# EAGLE design driver (EAGLE 6.1)

## Sheet 1 of 2
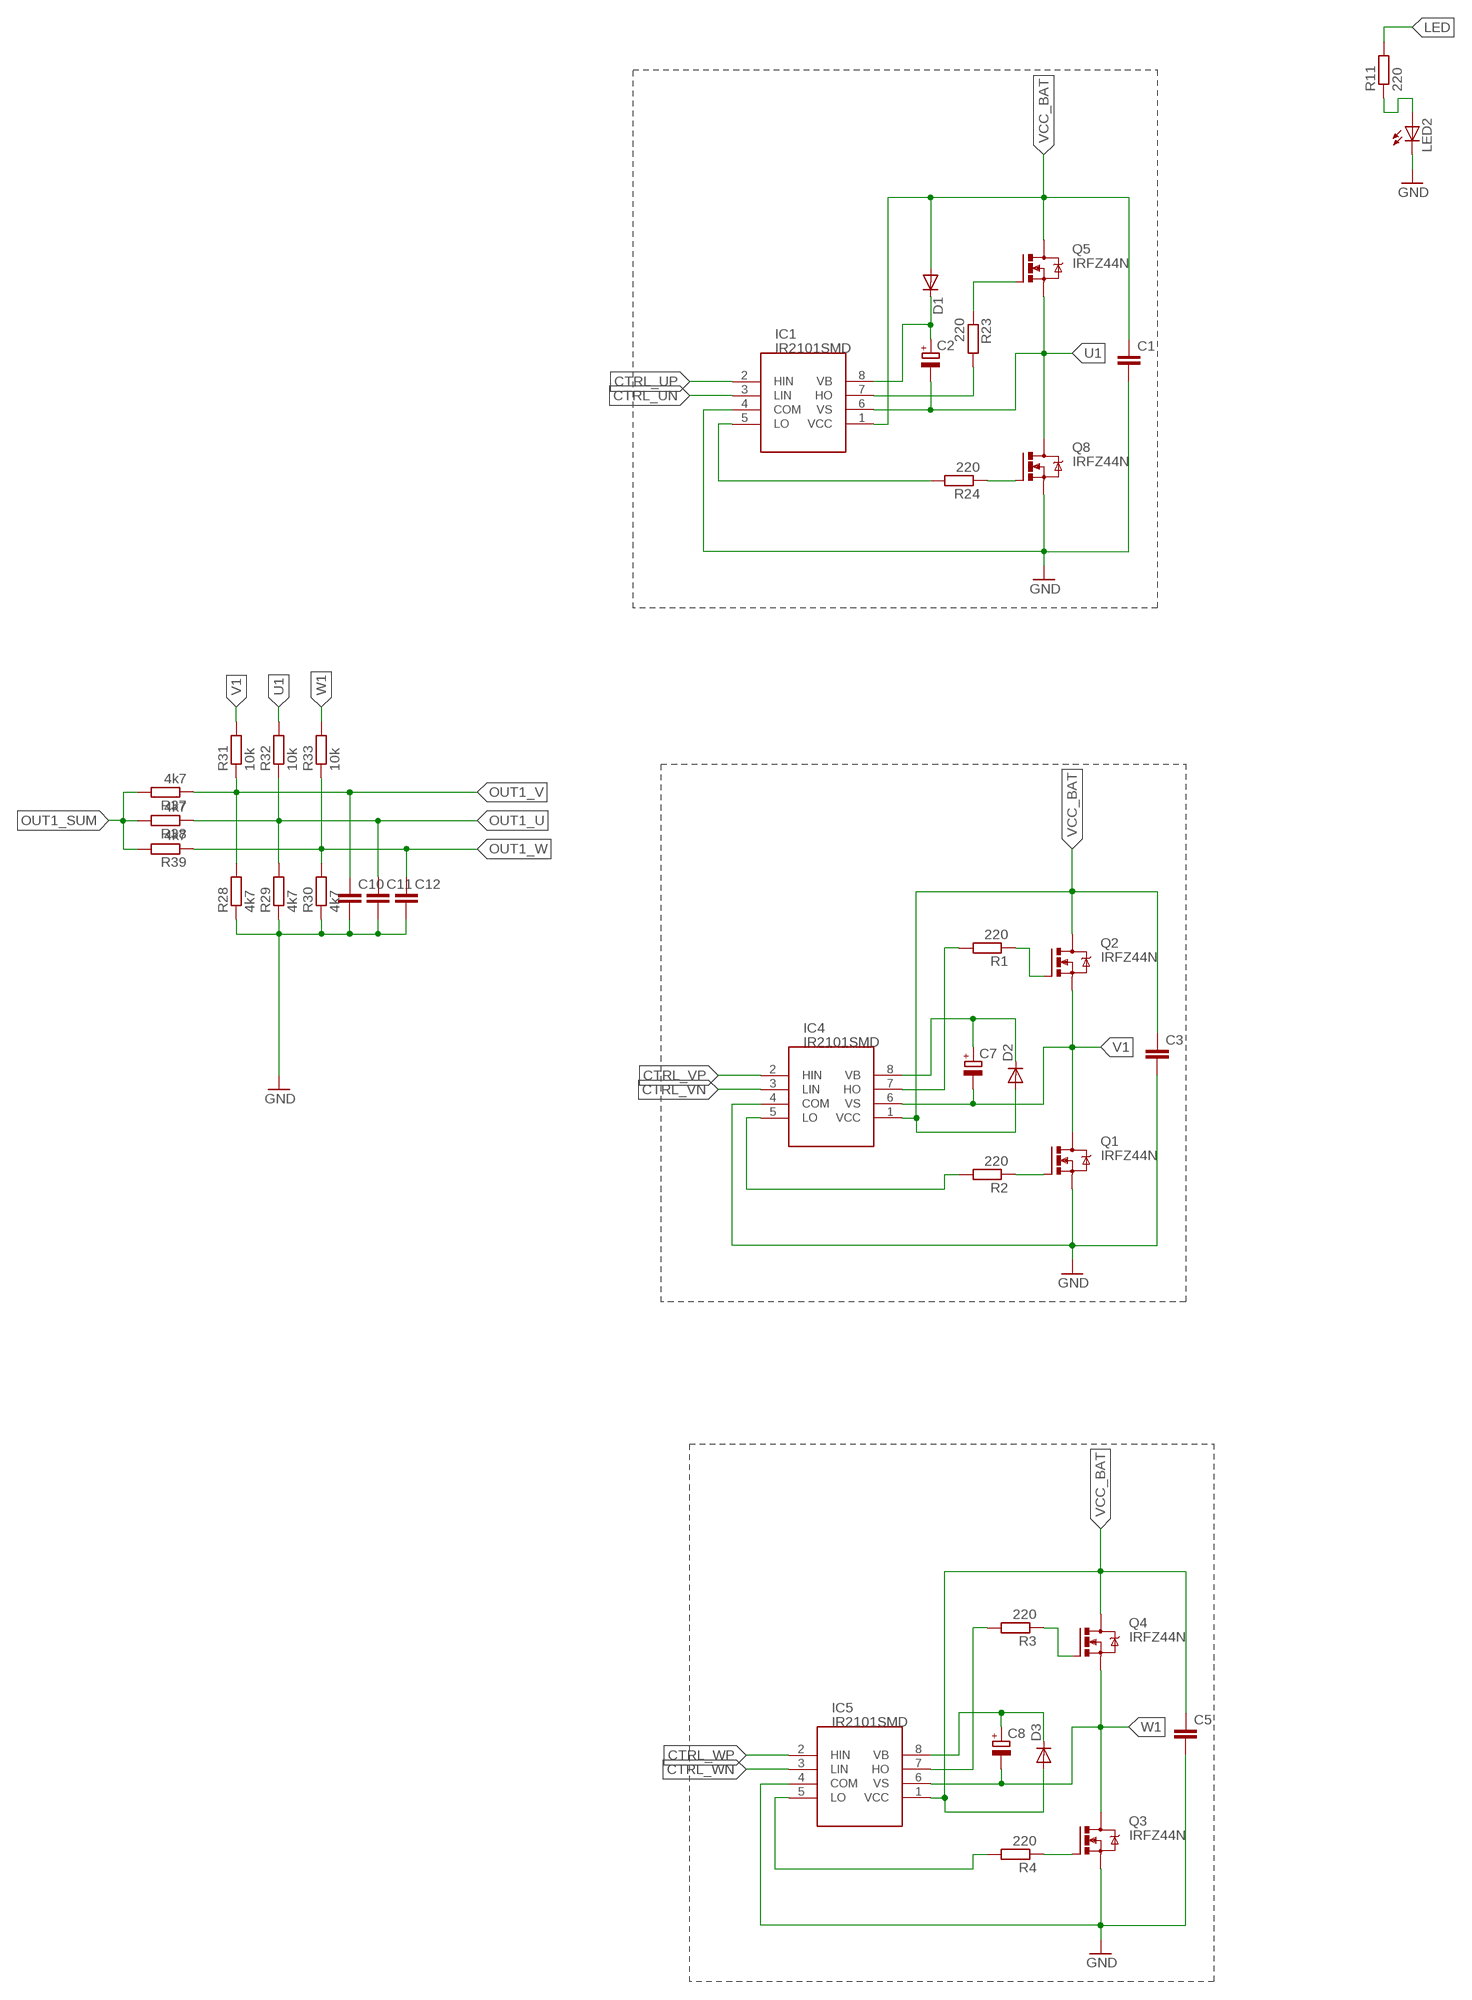
[diagram p0: schematic, sheet 1, part 1 of 2]
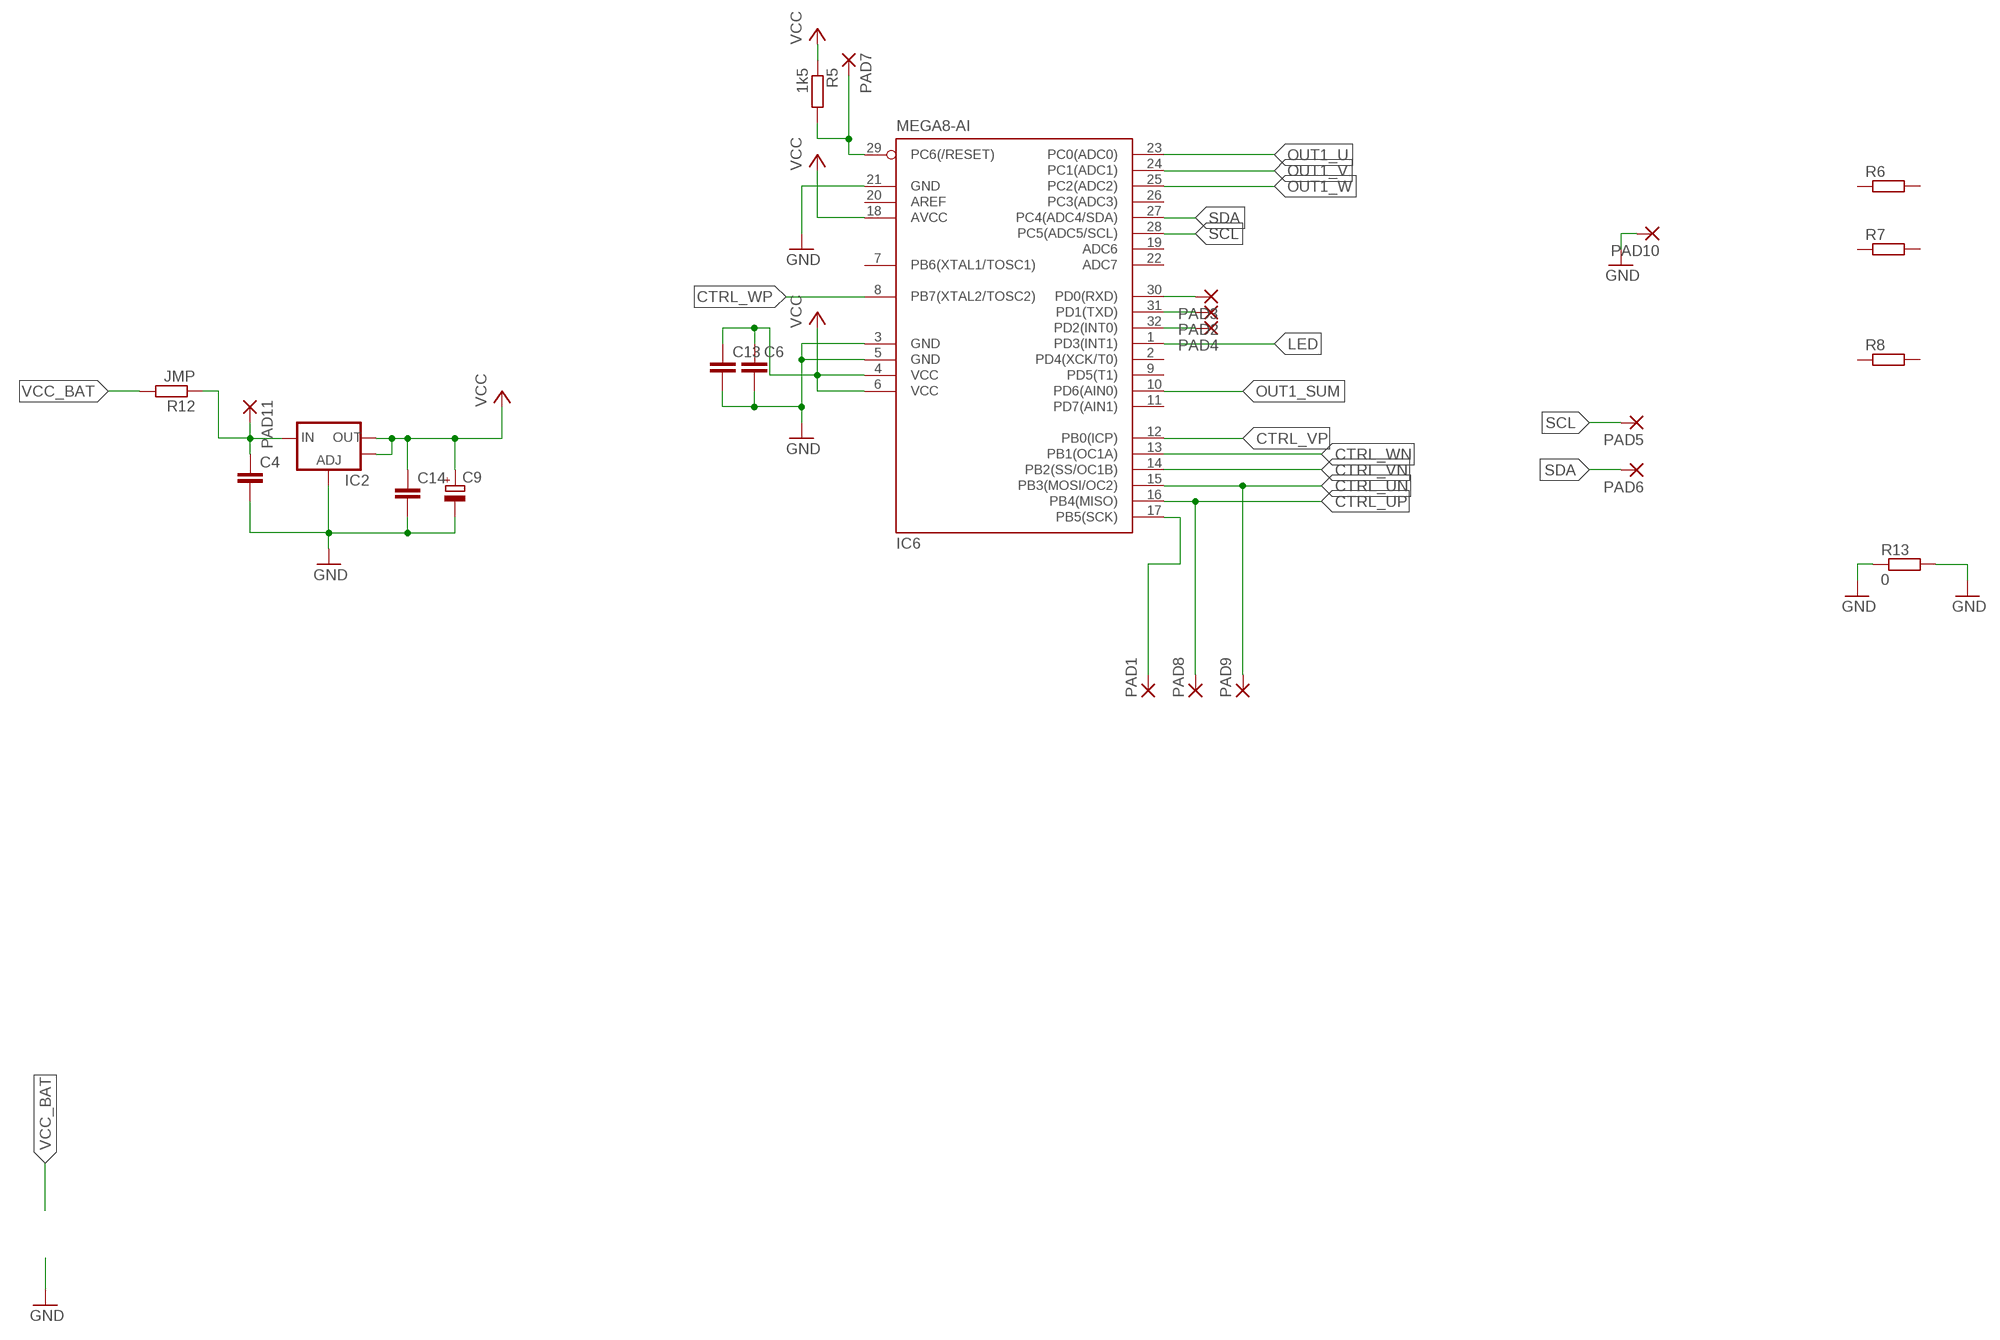
[diagram p1: schematic, sheet 1, part 2 of 2]

### Parts
C1  C-EUC0805  [C0805]
C2  CPOL-EUSANYO_SMD_A5  [SANYO-OSCON_SMD_A5]
C3  C-EUC0805  [C0805]
C4  C-EUC0805  [C0805]
C5  C-EUC0805  [C0805]
C6  C-EUC0805  [C0805]
C7  CPOL-EUSANYO_SMD_A5  [SANYO-OSCON_SMD_A5]
C8  CPOL-EUSANYO_SMD_A5  [SANYO-OSCON_SMD_A5]
C9  CPOL-EUSANYO_SMD_A5  [SANYO-OSCON_SMD_A5]
C10  C-EUC0805  [C0805]
C11  C-EUC1206  [C1206]
C12  C-EUC1206  [C1206]
C13  C-EUC0805  [C0805]
C14  C-EUC0805  [C0805]
D1  DIODE-MINIMELF  [MINIMELF]
D2  DIODE-MINIMELF  [MINIMELF]
D3  DIODE-MINIMELF  [MINIMELF]
IC1  IR2101SMD  [SO08]
IC2  V_REG_LM1117SOT223  [SOT223]
IC4  IR2101SMD  [SO08]
IC5  IR2101SMD  [SO08]
IC6  MEGA8-AI  [TQFP32-08]
LED2  LEDCHIPLED_0805  [CHIPLED_0805]
PAD1  SMD2  [SMD1,27-2,54]
PAD2  SMD2  [SMD1,27-2,54]
PAD3  SMD2  [SMD1,27-2,54]
PAD4  SMD2  [SMD1,27-2,54]
PAD5  SMD5  [SMD2,54-5,08]
PAD6  SMD5  [SMD2,54-5,08]
PAD7  SMD2  [SMD1,27-2,54]
PAD8  SMD2  [SMD1,27-2,54]
PAD9  SMD2  [SMD1,27-2,54]
PAD10  SMD5  [SMD2,54-5,08]
PAD11  SMD5  [SMD2,54-5,08]
Q1  IRFZ44N  IRFZ48  [TO220BH-FILL]
Q2  IRFZ44N  IRFZ48  [TO220BH-FILL]
Q3  IRFZ44N  IRFZ48  [TO220BH-FILL]
Q4  IRFZ44N  IRFZ48  [TO220BH-FILL]
Q5  IRFZ44N  IRFZ48  [TO220BH-FILL]
Q8  IRFZ44N  IRFZ48  [TO220BH-FILL]
R1  220  R-EU_R1206  [R1206]
R2  220  R-EU_R1206  [R1206]
R3  220  R-EU_R1206  [R1206]
R4  220  R-EU_R1206  [R1206]
R5  1k5  R-EU_R1206  [R1206]
R6  R-EU_R1206  [R1206]
R7  R-EU_R1206  [R1206]
R8  R-EU_R1206  [R1206]
R11  220  R-EU_R0805  [R0805]
R12  JMP  R-EU_R0805  [R0805]
R13  0  R-EU_R1206  [R1206]
R23  220  R-EU_R1206  [R1206]
R24  220  R-EU_R1206  [R1206]
R28  4k7  R-EU_R0805  [R0805]
R29  4k7  R-EU_R1206  [R1206]
R30  4k7  R-EU_R1206  [R1206]
R31  10k  R-EU_R0805  [R0805]
R32  10k  R-EU_R1206  [R1206]
R33  10k  R-EU_R1206  [R1206]
R37  4k7  R-EU_R0805  [R0805]
R38  4k7  R-EU_R0805  [R0805]
R39  4k7  R-EU_R1206  [R1206]

### Nets
CTRL_UN: IC1.3(LIN) IC6.15(PB3(MOSI/OC2)) PAD9.1(P)
CTRL_UP: IC1.2(HIN) IC6.16(PB4(MISO)) PAD8.1(P)
CTRL_VN: IC4.3(LIN) IC6.14(PB2(SS/OC1B))
CTRL_VP: IC4.2(HIN) IC6.12(PB0(ICP))
CTRL_WN: IC5.3(LIN) IC6.13(PB1(OC1A))
CTRL_WP: IC5.2(HIN) IC6.8(PB7(XTAL2/TOSC2))
GND: C1.2 C3.2 C4.2 C5.2 C6.2 C9.- C10.2 C11.2 C12.2 C13.2 C14.2 IC1.4(COM) IC2.1(ADJ) IC4.4(COM) IC5.4(COM) IC6.3(GND) IC6.5(GND) IC6.21(GND) LED2.C PAD10.1(P) Q1.S Q3.S Q8.S R13.1 R13.2 R28.1 R29.1 R30.1
LED: IC6.1(PD3(INT1)) R11.2
N$1: IC1.5(LO) R24.2
N$2: IC1.7(HO) R23.2
N$3: Q2.G R1.1
N$4: Q1.G R2.1
N$5: C2.+ D1.C IC1.8(VB)
N$6: IC4.5(LO) R2.2
N$7: IC4.7(HO) R1.2
N$8: C7.+ D2.C IC4.8(VB)
N$9: Q4.G R3.1
N$10: Q3.G R4.1
N$11: IC5.5(LO) R4.2
N$12: IC5.7(HO) R3.2
N$13: C8.+ D3.C IC5.8(VB)
N$14: IC6.29(PC6(/RESET)) PAD7.1(P) R5.2
N$16: IC6.17(PB5(SCK)) PAD1.1(P)
N$17: IC6.30(PD0(RXD)) PAD3.1(P)
N$18: IC6.31(PD1(TXD)) PAD2.1(P)
N$19: IC6.32(PD2(INT0)) PAD4.1(P)
N$22: Q5.G R23.1
N$24: Q8.G R24.1
N$27: LED2.A R11.1
N$29: C4.1 IC2.3(IN) PAD11.1(P) R12.1
OUT1_SUM: IC6.10(PD6(AIN0)) R37.2 R38.2 R39.2
OUT1_U: C11.1 IC6.23(PC0(ADC0)) R29.2 R32.1 R38.1
OUT1_V: C10.1 IC6.24(PC1(ADC1)) R28.2 R31.1 R37.1
OUT1_W: C12.1 IC6.25(PC2(ADC2)) R30.2 R33.1 R39.1
SCL: IC6.28(PC5(ADC5/SCL)) PAD5.1(P)
SDA: IC6.27(PC4(ADC4/SDA)) PAD6.1(P)
U1: C2.- IC1.6(VS) Q5.S Q8.D R32.2
V1: C7.- IC4.6(VS) Q1.D Q2.S R31.2
VCC: C6.1 C9.+ C13.1 C14.1 IC2.2(OUT) IC2.4(OUT) IC6.4(VCC) IC6.6(VCC) IC6.18(AVCC) R5.1
VCC_BAT: C1.1 C3.1 C5.1 D1.A D2.A D3.A IC1.1(VCC) IC4.1(VCC) IC5.1(VCC) Q2.D Q4.D Q5.D R12.2
W1: C8.- IC5.6(VS) Q3.D Q4.S R33.2
Unconnected: IC6.2(PD4(XCK/T0)) IC6.7(PB6(XTAL1/TOSC1)) IC6.9(PD5(T1)) IC6.11(PD7(AIN1)) IC6.19(ADC6) IC6.20(AREF) IC6.22(ADC7) IC6.26(PC3(ADC3)) R6.1 R6.2 R7.1 R7.2 R8.1 R8.2

## Sheet 2 of 2

## Library data of the parts
C1 C3-C6 C10-C14 = rcl-kd:C-EU: CAPACITOR, European symbol
C2 C7-C9 = rcl-kd:CPOL-EU: POLARIZED CAPACITOR, European symbol
D1-D3 = diode:DIODE-: DIODE
IC1 IC4 IC5 = IR:IR2101
IC2 = SparkFun:V_REG_LM1117: Voltage Regulator LM1117 Standard adjustable voltage regulator but in SMD form. Spark Fun Electronics SKU : COM-00595
IC6 = atmel:MEGA8: MICROCONTROLLER 8 Kbytes FLASH, 1 kbytes SRAM, 512 bytes EEPROM, USART, 6-channel 10 bit ADC, 2-channel 8 bit ADC Pin compatible with Atmega48, ATMega88, ATMega168 Source: avr.lbr; MPN: ATMEGA8-16AU; OC_FARNELL: 9171371; OC_NEWARK: 73M8863
LED2 = adafruit:LED: LED OSRAM: - CHIPLED LG R971, LG N971, LY N971, LG Q971, LY Q971, LO R971, LY R971 LH N974, LH R974 LS Q976, LO Q976, LY Q976 LO Q996 - Hyper CHIPLED LW Q18S LB Q993, LB Q99A, LB R99A - SideLED LS A670, LO A670, LY A670, LG A670, LP A670 LB A673, LV A673, LT A673, LW A673 LH A674 LY A675 LS A676, LA A676, LO A676, LY A676, LW A676 LS A679, LY A679, LG A679 - Hyper Micro SIDELED® LS Y876, LA Y876, LO Y876, LY Y876 LT Y87S - SmartLED LW L88C, LW L88S LB L89C, LB L89S, LG L890 LS L89K, LO L89K, LY L89K LS L896, LA L896, LO L896, LY L896 - TOPLED LS T670, LO T670, LY T670, LG T670, LP T670 LSG T670, LSP T670, LSY T670, LOP T670, LYG T670 LG T671, LOG T671, LSG T671 LB T673, LV T673, LT T673, LW T673 LH T674 LS T676, LA T676, LO T676, LY T676, LB T676, LH T676, LSB T676, LW T676 LB T67C, LV T67C, LT T67C, LS T67K, LO T67K, LY T67K, LW E67C LS E67B, LA E67B, LO E67B, LY E67B, LB E67C, LV E67C, LT E67C LW T67C LS T679, LY T679, LG T679 LS T770, LO T770, LY T770, LG T770, LP T770 LB T773, LV T773, LT T773, LW T773 LH T774 LS E675, LA E675, LY E675, LS T675 LS T776, LA T776, LO T776, LY T776, LB T776 LHGB T686 LT T68C, LB T68C - Hyper Mini TOPLED® LB M676 - Mini TOPLED Santana® LG M470 LS M47K, LO M47K, LY M47K Source: http://www.osram.convergy.de/
PAD1-PAD4 PAD7-PAD9 = wirepad:SMD2: SMD PAD
PAD5 PAD6 PAD10 PAD11 = wirepad:SMD5: SMD PAD
Q1-Q5 Q8 = transistor-power-kd:IRFZ48: N Channel HEXFET® Power MOSFET Logic Level Source: http://www.irf.com/product-info/datasheets/data/irfz48z.pdf
R1-R8 R13 R23 R24 R28-R33 R37-R39 = rcl-kd:R-EU_: RESISTOR, European symbol
R11 R12 = resistor:R-EU_: RESISTOR, European symbol

## Board
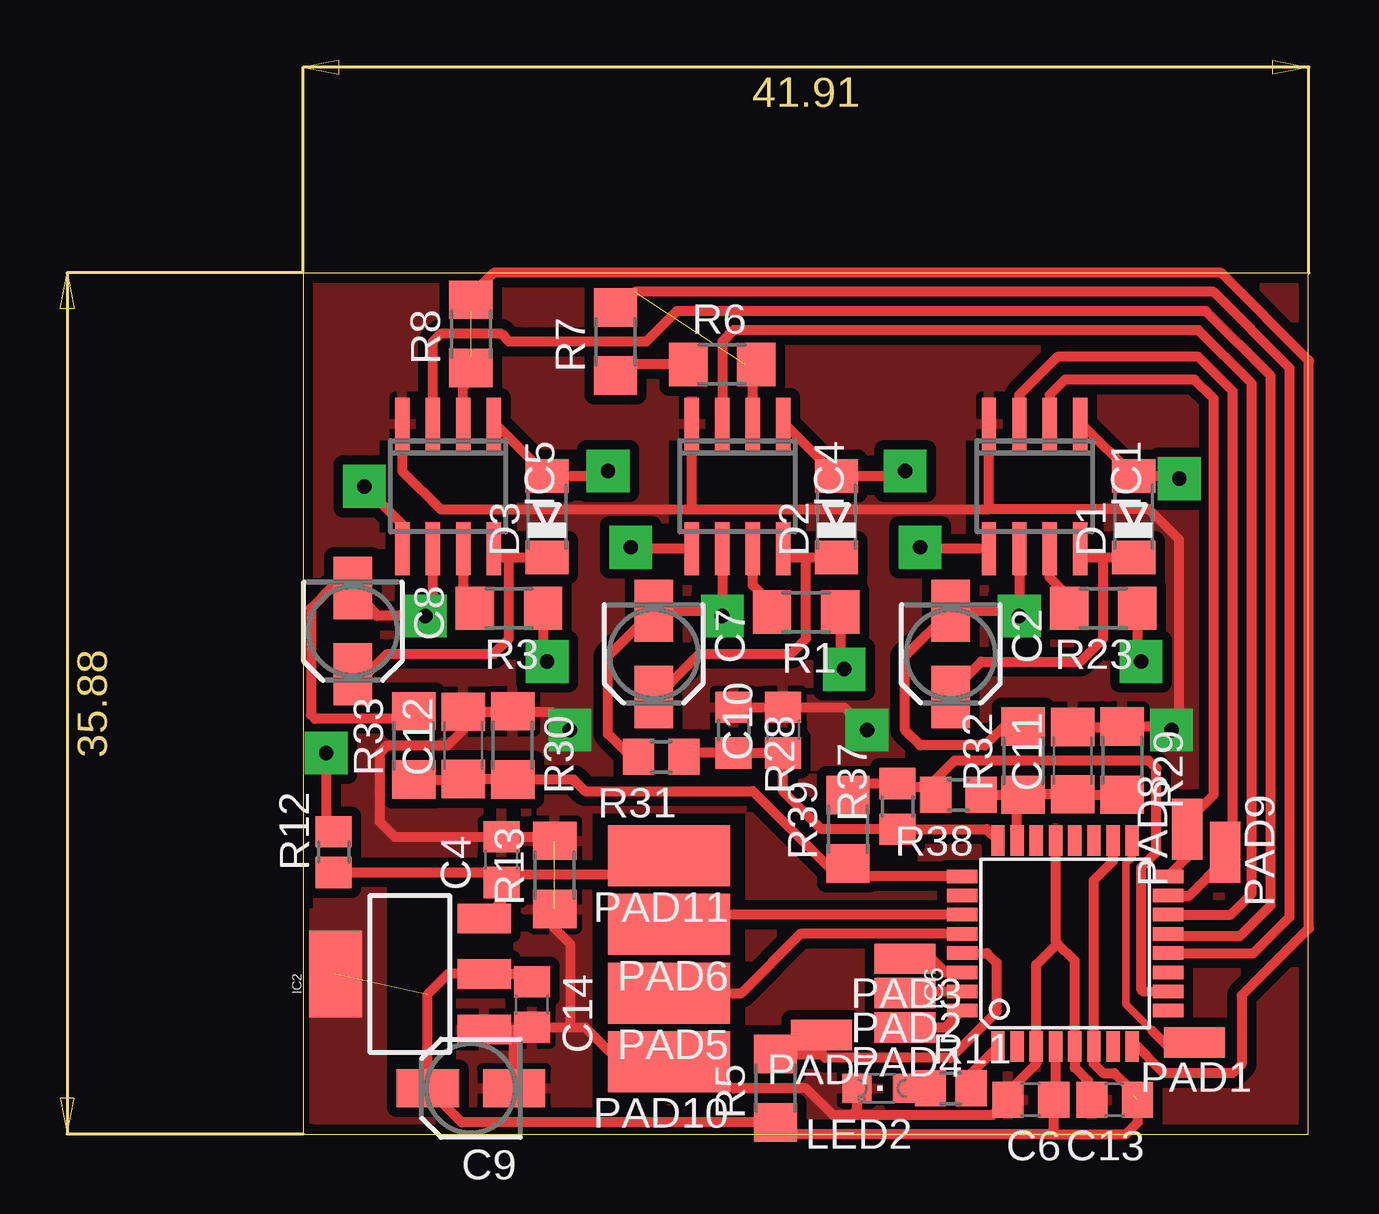
[diagram p2: board, top side]
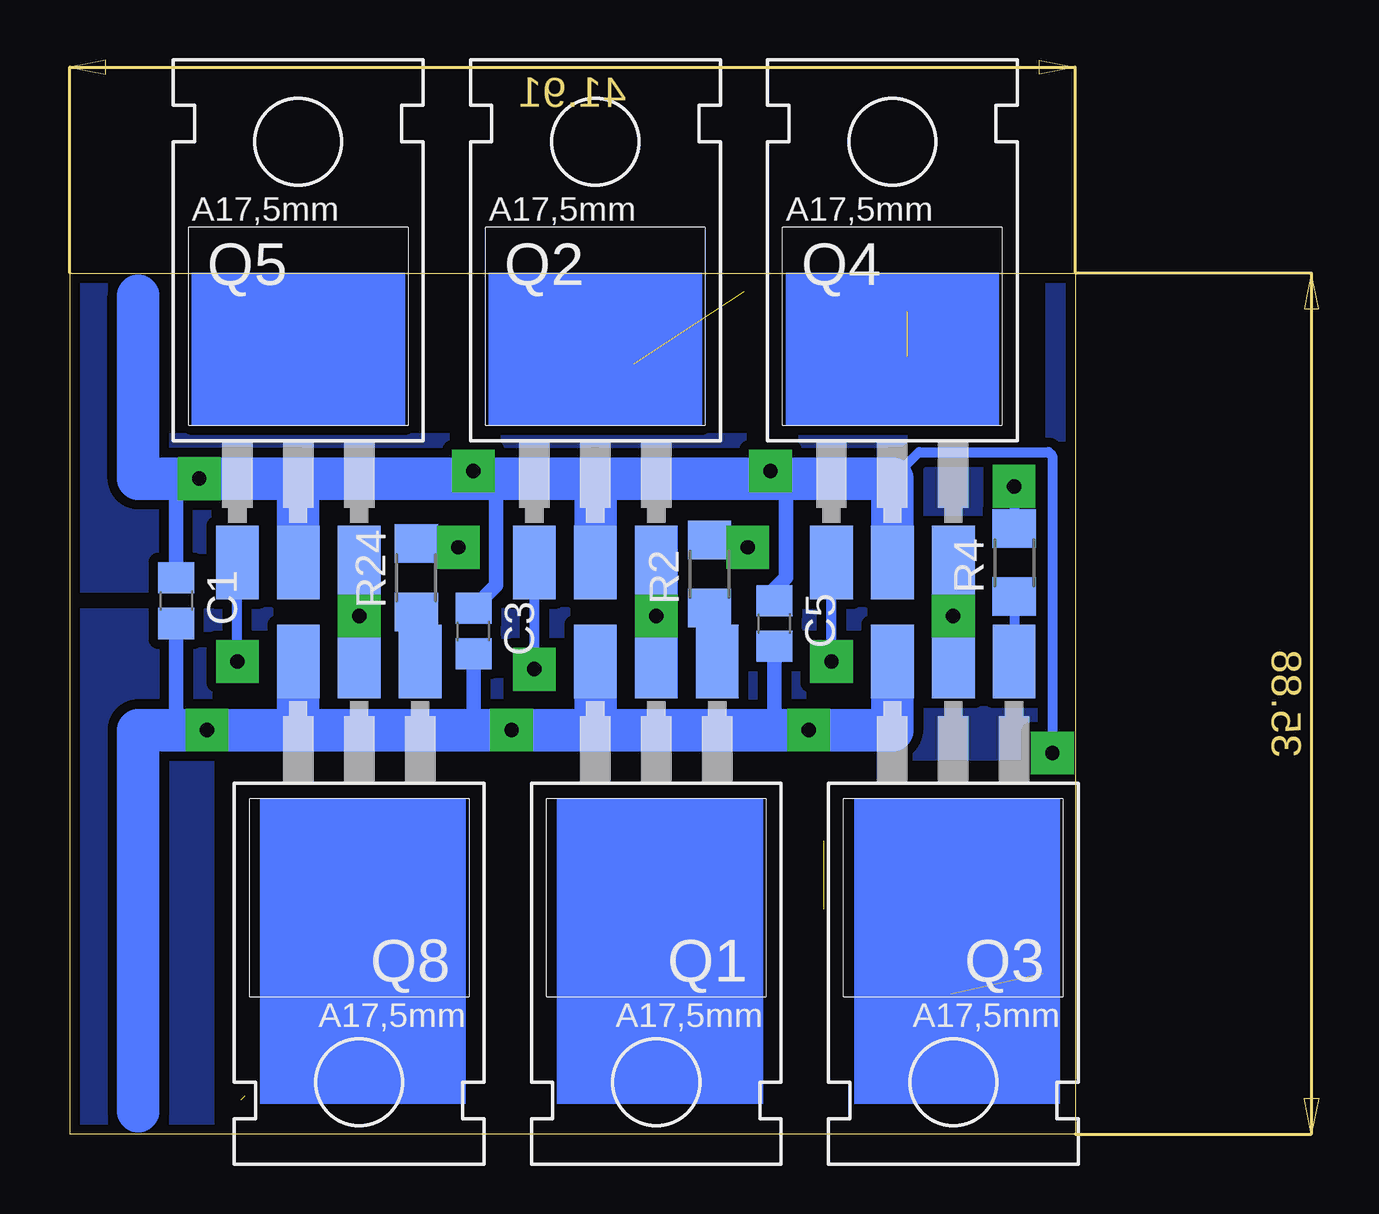
[diagram p3: board, bottom side, seen from below]

Size 41.89 x 35.87 mm. Coordinates in mm from the lower left corner, seen from the top.
Outline: 0,0 41.89,0 41.89,35.87 0,35.87 0,0
Copper layers (1*16): Top 0.035mm / dielectric 1.5mm / Bottom 0.035mm
Design rules: minimum track width 10mil, minimum drill 12mil, track to track 4mil, track to pad 4mil, pad to pad 4mil, via to via 4mil, smd to smd 4mil, copper to edge 10mil, drill to drill 8mil, minimum pad ring 10mil, minimum via ring 8mil, stop-mask expansion 4mil, vias tented up to drill 0mil, thermal gap 10mil

### Footprints (pad centres in the part's own frame; a part is rotated, then mirrored left to right if it is on the bottom)
C0805 = smd 1.3 x 1.5: 1 -0.95,0; 2 0.95,0
SANYO-OSCON_SMD_A5 = smd 2.6 x 1.6: + 1.8,0; - -1.8,0
C1206 = smd 1.6 x 1.8: 1 -1.4,0; 2 1.4,0
MINIMELF = smd 1.4 x 1.8: A 1.7,0; C -1.7,0
SO08 = smd 0.6 x 2.2: 1 -1.905,-2.6; 2 -0.635,-2.6; 3 0.635,-2.6; 4 1.905,-2.6; 5 1.905,2.6; 6 0.635,2.6; 7 -0.635,2.6; 8 -1.905,2.6
SOT223 = smd 1.219 x 2.235: 1 -2.311,-3.099; 2 0,-3.099; 3 2.311,-3.099 | smd 3.6 x 2.2: 4 0,3.099
TQFP32-08 = smd 1.27 x 0.559: 1 -4.293,2.8; 2 -4.293,2; 3 -4.293,1.2; 4 -4.293,0.4; 5 -4.293,-0.4; 6 -4.293,-1.2; 7 -4.293,-2; 8 -4.293,-2.8; 17 4.293,-2.8; 18 4.293,-2; 19 4.293,-1.2; 20 4.293,-0.4; 21 4.293,0.4; 22 4.293,1.2; 23 4.293,2; 24 4.293,2.8 | smd 0.559 x 1.27: 9 -2.8,-4.293; 10 -2,-4.293; 11 -1.2,-4.293; 12 -0.4,-4.293; 13 0.4,-4.293; 14 1.2,-4.293; 15 2,-4.293; 16 2.8,-4.293; 25 2.8,4.293; 26 2,4.293; 27 1.2,4.293; 28 0.4,4.293; 29 -0.4,4.293; 30 -1.2,4.293; 31 -2,4.293; 32 -2.8,4.293
CHIPLED_0805 = smd 1.2 x 1.2: A 0,-1.05; C 0,1.05
SMD1,27-2,54 = smd 1.27 x 2.54: 1 0,0
SMD2,54-5,08 = smd 2.54 x 5.08: 1 0,0
TO220BH-FILL = smd 1.778 x 3.048: D 0,-10.16; G -2.54,-10.16; S 2.54,-10.16
R1206 = smd 1.6 x 1.803: 1 -1.422,0; 2 1.422,0
R0805 = smd 1.3 x 1.5: 1 -0.85,0; 2 0.85,0
R0805' = smd 1.3 x 1.5: 1 -0.95,0; 2 0.95,0

### Placement (x,y rotation side)
C1  37.47,22.23 270 bottom
C2  26.99,20 270 top
C3  25.08,20.95 270 bottom
C4  8.26,11.43 90 top
C5  12.54,21.27 270 bottom
C6  30.32,1.43 180 top
C7  14.61,20 270 top
C8  2.06,20.95 270 top
C9  6.99,1.91 180 top
C10  20,16.83 90 top
C11  32.07,15.56 90 top
C12  6.67,16.19 90 top
C13  33.81,1.43 180 top
C14  9.53,5.4 270 top
D1  34.61,25.72 90 top
D2  22.23,25.72 90 top
D3  10.16,25.72 90 top
IC1  30.48,26.99 180 top
IC2  4.45,6.67 90 top
IC4  18.1,26.99 180 top
IC5  6.03,26.99 180 top
IC6  31.75,7.94 90 top
LED2  24.13,1.91 90 top
PAD1  37.15,3.81 90 top
PAD2  25.08,5.87 90 top
PAD3  25.08,7.3 90 top
PAD4  25.08,4.45 90 top
PAD5  15.24,5.87 90 top
PAD6  15.24,8.73 90 top
PAD7  21.59,4.13 90 top
PAD8  36.83,12.7 0 top
PAD9  38.42,11.75 180 top
PAD10  15.24,3.02 90 top
PAD11  15.24,11.59 90 top
Q1  17.46,9.53 180 bottom
Q2  20,33.97 0 bottom
Q3  5.08,9.53 180 bottom
Q4  7.62,33.97 0 bottom
Q5  32.38,33.97 0 bottom
Q8  29.84,9.53 180 bottom
R1  20.95,21.75 180 top
R2  15.24,23.34 90 bottom
R3  8.57,21.91 180 top
R4  2.54,23.81 90 bottom
R5  19.68,1.91 90 top
R6  17.46,32.07 0 top
R7  13.02,33.02 90 top
R8  6.99,33.34 90 top
R11  26.99,1.91 0 top
R12  1.27,11.75 90 top
R13  10.48,10.79 90 top
R23  33.34,21.91 180 top
R24  27.46,23.18 90 bottom
R28  4k7  [R0805']  17.94,16.83 270 top
R29  34.13,15.56 270 top
R30  8.73,16.19 270 top
R31  10k  [R0805']  14.92,15.72 180 top
R32  30,15.56 90 top
R33  4.6,16.19 90 top
R37  4k7  [R0805']  24.77,13.65 90 top
R38  4k7  [R0805']  27.3,14.13 180 top
R39  22.7,12.7 90 top

### Tracks (layer width: path | path; a pad name or v marks a point on that pad's centre or on a via)
CTRL_UN
  Top 0.406: IC1.3 29.84,30.8 31.43,32.38 37.31,32.38 38.73,30.96 38.73,11.75 PAD9.1 38.42,11.43 36.92,9.94 IC6.15
CTRL_UP
  Top 0.406: IC1.2 31.11,30.8 31.75,31.43 37.15,31.43 37.94,30.64 37.94,14.13 36.83,13.02 PAD8.1 36.83,11.53 IC6.16
CTRL_VN
  Top 0.406: IC4.3 17.46,33.02 17.94,33.5 37.31,33.5 39.53,31.27 39.53,10 38.66,9.14 IC6.14
CTRL_VP  (1 unrouted)
  Top 0.406: 13.02,34.29 13.81,35.08 37.94,35.08 41.12,31.91 41.12,9.05 39.6,7.54 IC6.12 | IC4.2 18.73,31.75 18.41,32.07
CTRL_WN
  Top 0.406: IC5.3 5.4,33.02 5.71,33.34 8.26,33.34 8.57,33.02 14.29,33.02 15.56,34.29 37.62,34.29 40.32,31.59 40.32,9.53 39.05,8.26 36.12,8.26 IC6.13
CTRL_WP  (1 unrouted)
  Top 0.406: 6.99,34.29 6.99,34.92 7.94,35.88 38.26,35.88 41.91,32.23 41.91,8.57 39.11,5.77 39.11,2.92 38.73,2.54 35.88,2.54 34.55,3.87 IC6.8 | IC5.2 6.67,31.11 6.99,31.43 6.99,32.38
GND  (via drill 0.6 pad 1.78)  (1 unrouted)
  Top 0.406: 8.87,17.59 C12.2 6.67,16.83 6.03,16.19 3.49,16.19 3.17,15.88 3.17,14.28 3.17,13.33 3.17,13.02 3.81,12.38 C4.2 10.31,12.38 R13.2 | 8.87,17.59 R30.1 | C13.2 32.7,1.75 32.7,2.22 32.15,2.77 IC6.5 32.15,7.22 31.43,7.94 | C11.2 33.79,16.96 R29.1 36.03,16.98 v36.2,16.83 36.51,17.14 36.51,24.77 35.24,26.04 28.57,26.04 | 31.43,7.94 30.55,7.05 IC6.3 30.55,2.93 29.37,1.75 C6.2 28.74,0.8 22.86,0.8 | IC6.21 31.35,8.02 31.43,7.94 | IC5.4 4.13,27.62 5.71,26.04 16.19,26.04 | 16.19,26.04 IC4.4 | 16.19,26.04 28.57,26.04 | 28.57,26.04 IC1.4 | 11.11,4.45 C14.2 9.43,4.67 9.53,4.36 | 11.11,4.45 11.75,4.45 13.18,3.02 PAD10.1 17.94,1.91 20.96,1.91 22.07,0.8 22.86,0.8 | IC2.1 9.53,4.36 | LED2.C 23.08,1.02 22.86,0.8 | C9.- 8.79,4.25 9.53,4.36 | 8.87,17.59 10.35,17.59 v11.11,16.83 | R28.1 C10.2 22.55,17.78 v23.5,16.83 v23.49,16.82 | R13.1 10.48,8.57 11.11,7.94 11.11,4.45
  Bottom 0.406: v23.5,16.83 20.95,16.51 20.64,16.83
  Bottom 0.61: C5.2 12.54,16.99 12.7,16.83 | C3.2 25.08,16.83 | C1.2 37.47,16.83
  Bottom 1.778: Q8.S 32.38,16.83 | 32.38,16.83 25.08,16.83 20.64,16.83 20,16.83 | 20,16.83 12.7,16.83 v11.11,16.83 7.62,16.83 Q3.S | Q1.S 20,16.83 | 32.38,16.83 v36.2,16.83 37.47,16.83 39.05,16.83 39.05,0.95
  pour Top (isolate 0.406): 0,35.88 41.91,35.88 41.91,0 0,0
LED
  Top 0.406: R11.2 27.84,2.53 IC6.1
N$1  (via drill 0.6 pad 1.78)
  Top 0.406: IC1.5 25.82,24.39 v25.72,24.45
  Bottom 0.406: v25.72,24.45 26.99,24.45 26.99,25.08 R24.2
N$2
  Top 0.406: IC1.7 31.11,23.18 31.75,22.54 31.75,22.07 R23.2
N$3  (via drill 0.6 pad 1.78)
  Top 0.406: R1.1 22.38,19.53 v22.54,19.37
  Bottom 0.406: v22.54,19.37 Q2.G
N$4
  Bottom 0.406: Q1.G 14.92,21.59 R2.1
N$5
  Top 0.406: 32.38,23.5 IC1.8 32.76,24.02 33.34,24.02 | D1.C 33.34,24.02 | C2.+ 26.77,18.2 28.26,19.68 32.38,19.68 33.34,20.64 33.34,24.02
N$6  (via drill 0.6 pad 1.78)
  Top 0.406: IC4.5 13.71,24.39 v13.65,24.45
  Bottom 0.406: v13.65,24.45 14.92,24.45 R2.2
N$7
  Top 0.406: R1.2 19.53,21.11 19.05,21.59 19.05,22.54 18.73,22.86 IC4.7
N$8
  Top 0.406: 20,23.81 IC4.8 20.37,24.02 20.95,24.02 | D2.C 20.95,24.02 | C7.+ 15.35,18.84 16.51,20 20.32,20 20.95,20.64 20.95,24.02
N$9  (via drill 0.6 pad 1.78)
  Top 0.406: 10.16,19.53 v10.16,19.68 9.99,19.85 R3.1
  Bottom 0.406: v10.16,19.68 Q4.G
N$10
  Bottom 0.406: R4.1 Q3.G
N$11  (via drill 0.6 pad 1.78)
  Top 0.406: IC5.5 4.13,25.4 v2.54,26.99
  Bottom 0.406: v2.54,26.99 R4.2
N$12
  Top 0.406: IC5.7 6.67,22.23 6.99,22.07 R3.2
N$13
  Top 0.406: D3.C 8.57,24.02 | 8.57,24.02 8.31,24.02 IC5.8 | 8.57,24.02 8.57,20.64 7.94,20 3.49,20 1.91,18.41 C8.+
N$14
  Top 0.406: IC6.29 28.5,7.54 28.89,7.14 28.89,5.08 26.99,3.17 21.75,3.17 21.6,3.33 21.59,3.33 | R5.2 21.59,3.33 | PAD7.1 21.59,3.33
N$16
  Top 0.305: IC6.17 34.55,11.53 34.29,11.27 34.29,5.4 35.4,4.29
  Top 0.406: 35.4,4.29 36.2,3.49 PAD1.1
N$17
  Top 0.406: PAD3.1 26.19,7.3 26.76,6.74 IC6.30
N$18
  Top 0.406: IC6.31 25.15,5.94 PAD2.1
N$19
  Top 0.406: PAD4.1 26.77,4.45 IC6.32
N$21
  Top 0.406: 16.51,32.07 13.34,32.07
N$22  (via drill 0.6 pad 1.78)
  Top 0.406: R23.1 34.76,19.85 v34.92,19.68
  Bottom 0.406: v34.92,19.68 Q5.G
N$23
  cutout Top: 28.26,11.43 35.24,11.43 35.24,4.45 28.26,4.45
  cutout Top: 3.49,10.16 6.35,10.16 6.35,2.86 3.49,2.86
  cutout Top: 3.17,28.89 8.89,28.89 8.89,25.08 3.17,25.08
  cutout Top: 15.24,28.89 20.95,28.89 20.95,25.08 15.24,25.08
  cutout Top: 27.62,28.89 33.34,28.89 33.34,25.08 27.62,25.08
  cutout Top: 12.06,13.34 18.41,13.34 18.41,1.27 12.06,1.27
N$24
  Bottom 0.406: Q8.G 27.3,22.23 R24.1
N$25
  pour Bottom (isolate 0.406): 0,35.88 41.91,35.88 41.91,0 0,0
N$26
  cutout Bottom: -0.32,15.56 35.88,15.56 35.88,0 -0.32,0
  cutout Bottom: 1.27,35.88 38.42,35.88 38.42,29.21 1.27,29.21
N$27
  Top 0.406: LED2.A R11.1
N$28
  cutout Bottom: 35.88,22.54 41.59,22.54 41.59,21.91 35.88,21.91
N$29
  Top 0.406: PAD11.1 14.45,10.8 8.57,10.8 C4.1 | R12.1 7.84,10.9 C4.1 | C4.1 8.26,9.69 IC2.3
N$30
  cutout Bottom: 1.59,24.45 3.49,24.45 3.49,23.18 1.59,23.18
  cutout Bottom: 14.29,23.97 16.19,23.97 16.19,22.7 14.29,22.7
  cutout Bottom: 26.51,23.81 28.42,23.81 28.42,22.54 26.51,22.54
OUT1_SUM
  Top 0.406: IC6.10 35.02,5.94 34.92,6.03 34.92,11.11 35.56,11.75 35.56,15.24 35.24,15.56 27.15,15.56 26.04,14.45 | 26.04,14.61 26.04,14.45 | 26.04,14.45 R38.2 | 26.04,14.45 25.08,14.45 R37.2 23.34,14.6 R39.2
OUT1_U
  Top 0.406: IC6.23 29.75,13.88 R32.1 | 30.15,14.29 R32.1 | 33.82,14.13 R29.2 32.09,14.14 C11.1 30.03,14.16 R32.1 | R38.1 30,14.13 R32.1
OUT1_V
  Top 0.406: R31.1 16.03,15.88 R28.2 C10.1 20,14.29 21.59,12.7 R37.1 28.48,12.7 IC6.24
OUT1_W
  Top 0.406: R33.1 6.65,14.77 C12.1 8.87,14.79 R30.2 11.27,14.76 11.75,14.29 18.73,14.29 22.28,10.74 22.86,10.74 | IC6.25 22.86,10.74 | R39.1 22.86,10.74
SCL
  Top 0.406: IC6.28 20.72,8.34 18.26,5.87 PAD5.1
SDA
  Top 0.406: IC6.27 15.65,9.14 PAD6.1 15.4,8.57
U1  (via drill 0.6 pad 1.78)
  Top 0.406: IC1.6 v29.84,21.59 29.63,21.8 C2.- 25.08,19.9 25.08,16.83 25.72,16.19 28.42,16.19 29.37,17.14 29.84,17.14 R32.2
  Bottom 0.406: v29.84,21.59 Q8.D
  Bottom 1.778: Q5.S v29.84,21.59
V1  (via drill 0.6 pad 1.78)
  Top 0.406: IC4.6 v17.46,21.59 17.25,21.8 C7.- 12.7,19.9 12.7,16.67 13.65,15.72 R31.2
  Bottom 1.778: Q2.S v17.46,21.59 Q1.D
VCC  (2 unrouted)
  Top 0.406: IC6.18 33.75,11.37 32.95,10.57 IC6.6 32.95,2.93 33.34,2.54 33.81,2.54 34.45,1.91 34.45,1.75 34.61,1.59 | IC6.4 31.35,1.67 C6.1 31.27,0.16 31.11,0 | C13.1 34.76,0.47 34.29,0 31.11,0 | 31.11,0 20.17,0 R5.1 6.61,0.48 C9.+ 5.18,5.82 6.03,6.67 IC2.2 9.21,6.67 C14.1
  pour Top (no thermals): 0.32,9.21 3.49,9.21 3.49,3.81 2.86,3.17 2.86,0.64 0.32,0.64
VCC_BAT  (via drill 0.6 pad 1.78)
  Top 0.406: v12.7,27.62 12.59,27.42 D3.A 7.99,29.59 IC5.1 | v25.08,27.62 24.97,27.42 D2.A 20.05,29.59 IC4.1 | v36.51,27.3 36.4,27.42 D1.A 32.44,29.59 IC1.1 | v0.95,15.88 0.95,12.28 R12.2
  Bottom 0.406: 13.02,26.99 12.7,27.3 | 24.52,27.3 25.08,27.3 | 7.62,27.3 6.51,28.42 1.11,28.42 0.95,28.26 v0.95,15.88
  Bottom 0.61: C5.1 12.54,22.7 12.06,23.18 12.06,27.3 | C3.1 24.13,22.86 24.13,27.3 | C1.1 37.47,26.99 37.78,27.3
  Bottom 1.778: Q5.D 32.38,27.3 | 32.38,27.3 25.08,27.3 | v25.08,27.62 25.08,27.3 | 25.08,27.3 24.13,27.3 20,27.3 | 20,27.3 12.7,27.3 | v12.7,27.62 12.7,27.3 | 12.7,27.3 12.06,27.3 7.62,27.3 Q4.D | Q2.D 20,27.3 | 32.38,27.3 v36.51,27.3 37.78,27.3 39.05,27.3 39.05,34.92
W1  (via drill 0.6 pad 1.78)
  Top 0.406: IC5.6 5.4,21.91 v5.08,21.59 3.07,21.59 C8.- 1.17,22.75 0.32,21.91 0.32,17.46 0.48,17.3 3.98,17.3 4.45,17.46 | R33.2 4.45,17.46 | 4.28,17.3 4.45,17.46
  Bottom 1.778: Q4.S v5.08,21.59 Q3.D
(copper drawn outside any net)
  shapes: Bottom area x6